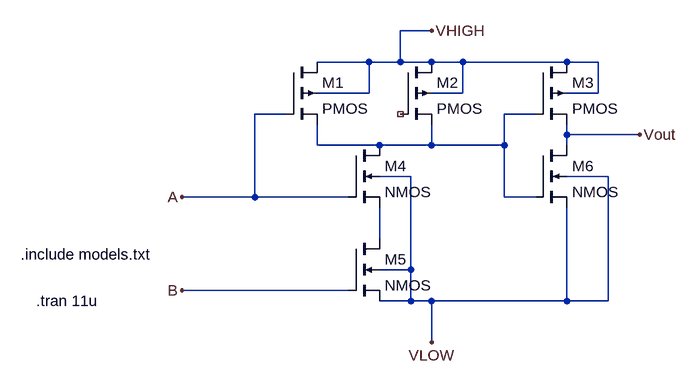
[diagram p0: schematic AND.asc]
AND.asc, the LTspice schematic file:
Version 4
SHEET 1 880 708
WIRE 256 -32 208 -32
WIRE 160 16 80 16
WIRE 208 16 208 -32
WIRE 208 16 160 16
WIRE 256 16 208 16
WIRE 304 16 256 16
WIRE 464 16 304 16
WIRE 512 16 464 16
WIRE 160 64 160 16
WIRE 160 64 80 64
WIRE 304 64 304 16
WIRE 304 64 256 64
WIRE 512 64 512 16
WIRE 512 64 464 64
WIRE 32 96 -16 96
WIRE 416 96 368 96
WIRE 464 128 464 112
WIRE 576 128 464 128
WIRE 80 144 80 112
WIRE 176 144 80 144
WIRE 256 144 256 112
WIRE 256 144 176 144
WIRE 368 144 368 96
WIRE 368 144 256 144
WIRE 464 144 464 128
WIRE 224 192 176 192
WIRE 528 192 464 192
WIRE -16 224 -16 96
WIRE -16 224 -128 224
WIRE 128 224 -16 224
WIRE 368 224 368 144
WIRE 416 224 368 224
WIRE 176 288 176 240
WIRE 224 336 224 192
WIRE 224 336 176 336
WIRE 128 368 -128 368
WIRE 224 384 224 336
WIRE 224 384 176 384
WIRE 256 384 224 384
WIRE 464 384 464 240
WIRE 464 384 256 384
WIRE 528 384 528 192
WIRE 528 384 464 384
WIRE 256 448 256 384
FLAG -128 224 A
FLAG -128 368 B
FLAG 256 -32 VHIGH
FLAG 576 128 Vout
FLAG 256 448 VLOW
SYMBOL pmos4 32 16 R0
SYMATTR InstName M1
SYMATTR Value2 l=50n w=1u
SYMBOL pmos4 208 16 R0
SYMATTR InstName M2
SYMATTR Value2 l=50n w=1u
SYMBOL pmos4 416 16 R0
SYMATTR InstName M3
SYMATTR Value2 l=50n w=1u
SYMBOL nmos4 128 144 R0
SYMATTR InstName M4
SYMATTR Value2 l=50n w=0.5u
SYMBOL nmos4 128 288 R0
SYMATTR InstName M5
SYMATTR Value2 l=50n w=0.5u
SYMBOL nmos4 416 144 R0
SYMATTR InstName M6
SYMATTR Value2 l=50n w=0.5u
TEXT -376 312 Left 2 !.include models.txt
TEXT -352 384 Left 2 !.tran 11u

The netlist it stands for:
* AND.asc
M1 VHIGH A N001 VHIGH PMOS l=50n w=1u
M2 VHIGH NC_01 N001 VHIGH PMOS l=50n w=1u
M3 VHIGH N001 Vout VHIGH PMOS l=50n w=1u
M4 N001 A N002 VLOW NMOS l=50n w=0.5u
M5 N002 B VLOW VLOW NMOS l=50n w=0.5u
M6 Vout N001 VLOW VLOW NMOS l=50n w=0.5u
.model NMOS NMOS
.model PMOS PMOS
.lib standard.mos
.include models.txt
.tran 11u
.backanno
.end